# Altium schematic sheet Expansion_Connector.SchDoc: EXPANSION_Connector
size A4; CompanyName: STMicroelectronics; Organization: Microcontrollers Division; Address1: 12, Rue Jules HOROWITZ; Address2: 38019 Grenoble; Address3: FRANCE; DocumentNumber: MB1272; Revision: A-01; SheetNumber: 16; SheetTotal: 18; Project: STM32MP15-DISCO PI; DocumentName: ARDUINO_ Connectors.SchDoc
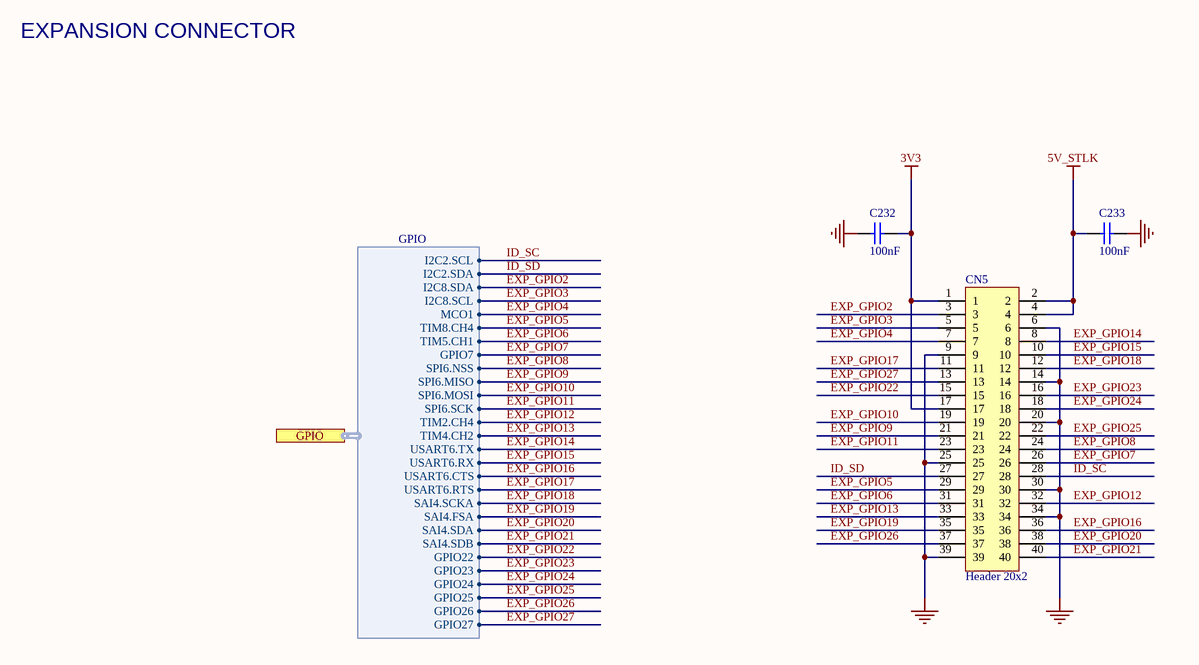
[diagram p0: Expansion_Connector.SchDoc]

## Parts
C232  value 100nF  [C0402]  (hidden comment: Capacitor)
C233  value 100nF  [C0402]  (hidden comment: Capacitor)
CN5  Header 20x2  [CON_SAMTEC_TSW-120-07-G-D]

## Ports
GPIO (harness GPIO)

## Harnesses
GPIO: I2C2.SCL, I2C2.SDA, I2C8.SDA, MCO1, TIM8.CH4, TIM5.CH1, GPIO7, SPI6.NSS, SPI6.MISO, SPI6.MOSI, SPI6.SCK, TIM2.CH4, TIM4.CH2, USART6.TX, USART6.RX, USART6.CTS, USART6.RTS, I2C8.SCL, SAI4.SCKA, SAI4.FSA, SAI4.SDA, SAI4.SDB, GPIO22, GPIO23, GPIO24, GPIO25, GPIO26, GPIO27

## Nets
3V3: C232.1 CN5.1 CN5.17
5V_STLK: C233.2 CN5.2 CN5.4
GND: C232.2 C233.1 CN5.6 CN5.9 CN5.14 CN5.20 CN5.25 CN5.30 CN5.34 CN5.39
EXP_GPIO2: CN5.3 ; port GPIO.I2C8.SDA
EXP_GPIO3: CN5.5 ; port GPIO.I2C8.SCL
EXP_GPIO4: CN5.7 ; port GPIO.MCO1
EXP_GPIO5: CN5.29 ; port GPIO.TIM8.CH4
EXP_GPIO6: CN5.31 ; port GPIO.TIM5.CH1
EXP_GPIO7: CN5.26 ; port GPIO.GPIO7
EXP_GPIO8: CN5.24 ; port GPIO.SPI6.NSS
EXP_GPIO9: CN5.21 ; port GPIO.SPI6.MISO
EXP_GPIO10: CN5.19 ; port GPIO.SPI6.MOSI
EXP_GPIO11: CN5.23 ; port GPIO.SPI6.SCK
EXP_GPIO12: CN5.32 ; port GPIO.TIM2.CH4
EXP_GPIO13: CN5.33 ; port GPIO.TIM4.CH2
EXP_GPIO14: CN5.8 ; port GPIO.USART6.TX
EXP_GPIO15: CN5.10 ; port GPIO.USART6.RX
EXP_GPIO16: CN5.36 ; port GPIO.USART6.CTS
EXP_GPIO17: CN5.11 ; port GPIO.USART6.RTS
EXP_GPIO18: CN5.12 ; port GPIO.SAI4.SCKA
EXP_GPIO19: CN5.35 ; port GPIO.SAI4.FSA
EXP_GPIO20: CN5.38 ; port GPIO.SAI4.SDA
EXP_GPIO21: CN5.40 ; port GPIO.SAI4.SDB
EXP_GPIO22: CN5.15 ; port GPIO.GPIO22
EXP_GPIO23: CN5.16 ; port GPIO.GPIO23
EXP_GPIO24: CN5.18 ; port GPIO.GPIO24
EXP_GPIO25: CN5.22 ; port GPIO.GPIO25
EXP_GPIO26: CN5.37 ; port GPIO.GPIO26
EXP_GPIO27: CN5.13 ; port GPIO.GPIO27
ID_SC: CN5.28 ; port GPIO.I2C2.SCL
ID_SD: CN5.27 ; port GPIO.I2C2.SDA

## Notes on the sheet
- EXPANSION CONNECTOR
- Title:
- Project:
- Size:
- Revision:
- Variant:
- A4
- -
- Date:
- Reference:
- Sheet:
- of

## Library data of the parts
C232 C233 = MCD-00006: Capacitor, MLCC, 100nF, 16V, X7R, +/-10%, 0402, T=0.5mm; Part_Preference: Recommended; Manufacturer: YAGEO; Manufacturer_Part_Number: CC0402KRX7R7BB104; Partial_Alternate_Internal_Part_Number: MCD-03299; Order_Code_RS: 616-9701; Component_Country_Of_Origin: China; ShowFields: YES; ID: 2474; Alternate_EMS: M; Internal_Part_Number: MCD-00006; Status: Released; Part_Type: Capacitor; Package: 0402; ComponentLink1URL: http://tunmcdsvn.tun.st.com/Component_Documentation_Library/Trunk/Capacitor/YAGEO_X7R_Series; Order_Code_Digikey: 311-1338-1-ND; Order_Code_Farnell: 9402047
CN5 = MCD-00302: Header, 20x2, 2.54mm, VR, TH, T=5.84mm/2.54mm; Manufacturer_Part_Number: TSW-120-07-G-D; Manufacturer: SAMTEC; Part_Type: Connector; Part_Preference: Recommended; Order_Code_RS: 180-2456; Component_Country_Of_Origin: China, Costa Rica, Malaysia, United States, Vietnam; ShowFields: YES; ID: 2567; Internal_Part_Number: MCD-00302; Value: Header 20x2; ComponentLink1URL: http://tunmcdsvn.tun.st.com/Component_Documentation_Library/Trunk/Connector/SAMTEC_TSW_Series/; Status: Released; Order_Code_Digikey: SAM1028-20-ND; Order_Code_Farnell: 2779689